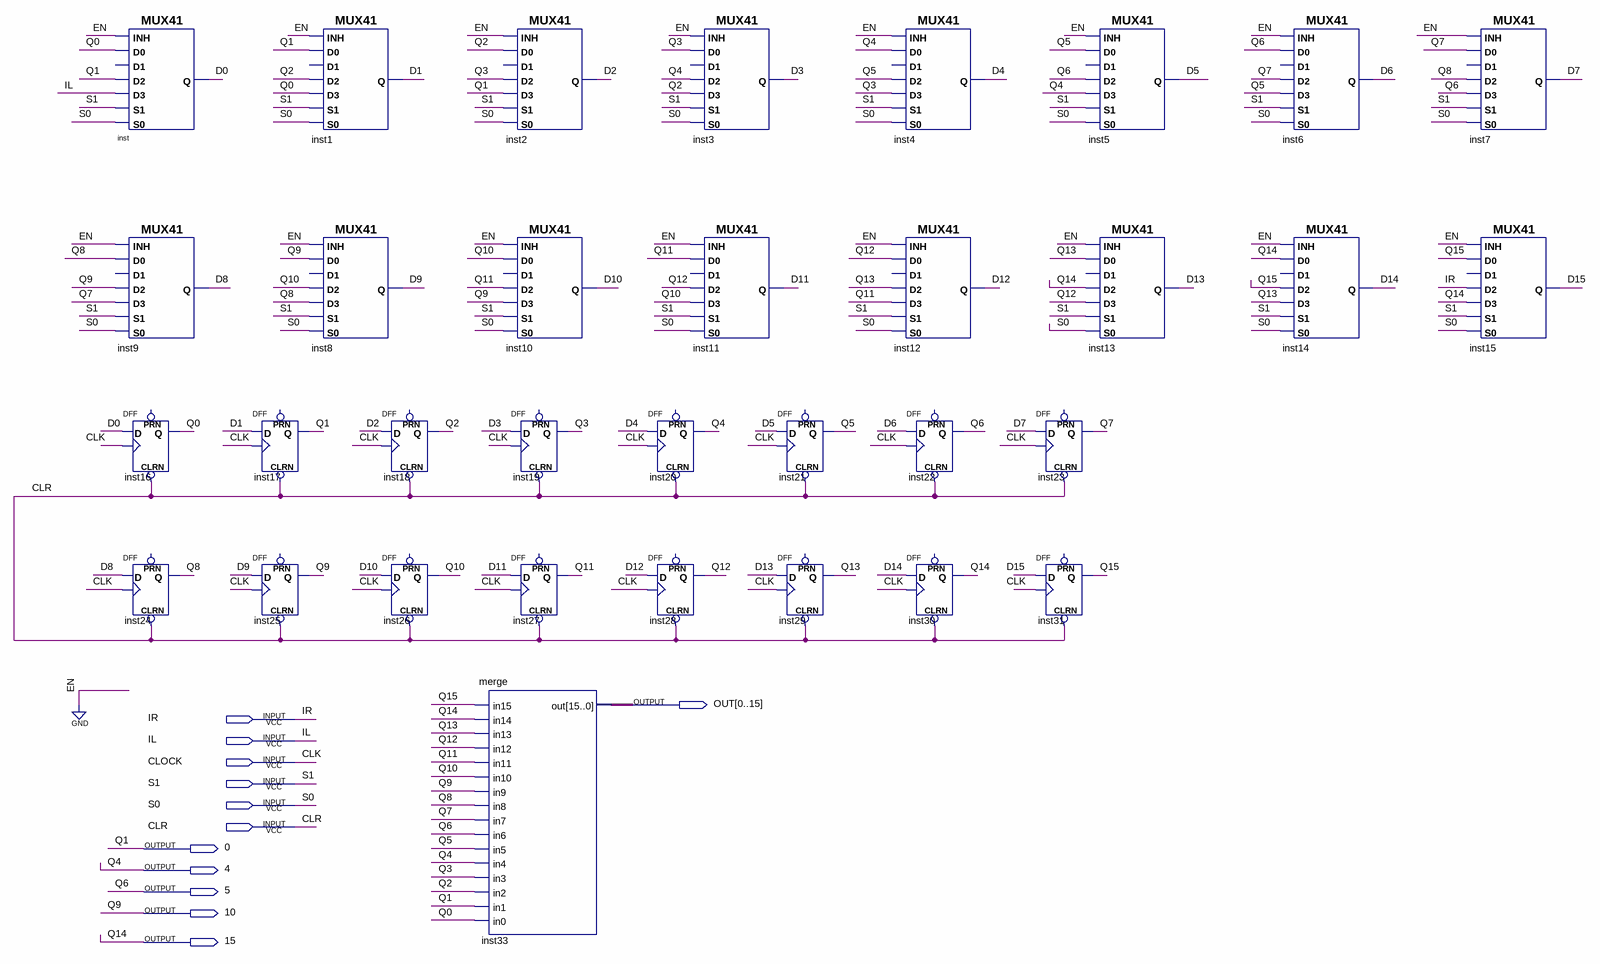
[diagram p0: schematic sheet]
// Quartus schematic Block2.bdf as structural Verilog: 33 symbols, 12 pins
module Block2 (
  input  IR,
  input  IL,
  input  CLOCK,
  input  S1,
  input  S0,
  input  CLR,
  output [0:15] OUT,
  output \0 ,
  output \4 ,
  output \5 ,
  output \10 ,
  output \15 
);

  wire D0, D1, D2, D3, D4, D5, D6, D7, D8, D9, D10, D11, D12, D13, D14, D15, Q0, Q2, Q3, Q5, Q7, Q8, Q10,
       Q11, Q12, Q13, Q15;

  MUX41 inst (.S0(S0), .D2(\0 ), .S1(S1), .D3(IL), .D0(Q0), .INH(1'b0), .Q(D0));  // open: D1
  MUX41 inst9 (.S0(S0), .D2(\10 ), .S1(S1), .D3(Q7), .D0(Q8), .INH(1'b0), .Q(D8));  // open: D1
  DFF inst16 (.CLRN(CLR), .CLK(CLOCK), .D(D0), .Q(Q0));  // open: PRN
  DFF inst24 (.CLRN(CLR), .CLK(CLOCK), .D(D8), .Q(Q8));  // open: PRN
  DFF inst17 (.CLRN(CLR), .CLK(CLOCK), .D(D1), .Q(\0 ));  // open: PRN
  DFF inst25 (.CLRN(CLR), .CLK(CLOCK), .D(D9), .Q(\10 ));  // open: PRN
  MUX41 inst1 (.S0(S0), .D2(Q2), .S1(S1), .D3(Q0), .D0(\0 ), .INH(1'b0), .Q(D1));  // open: D1
  MUX41 inst8 (.S0(S0), .D2(Q10), .S1(S1), .D3(Q8), .D0(\10 ), .INH(1'b0), .Q(D9));  // open: D1
  DFF inst18 (.CLRN(CLR), .CLK(CLOCK), .D(D2), .Q(Q2));  // open: PRN
  DFF inst26 (.CLRN(CLR), .CLK(CLOCK), .D(D10), .Q(Q10));  // open: PRN
  MUX41 inst2 (.S0(S0), .D2(Q3), .S1(S1), .D3(\0 ), .D0(Q2), .INH(1'b0), .Q(D2));  // open: D1
  MUX41 inst10 (.S0(S0), .D2(Q11), .S1(S1), .D3(\10 ), .D0(Q10), .INH(1'b0), .Q(D10));  // open: D1
  merge inst33 (
    .in15(Q15), .in14(\15 ), .in13(Q13), .in12(Q12), .in11(Q11), .in10(Q10), .in9(\10 ), .in8(Q8), .in7(Q7),
    .in6(\5 ), .in5(Q5), .in4(\4 ), .in3(Q3), .in2(Q2), .in1(\0 ), .in0(Q0), .out(OUT));
  DFF inst19 (.CLRN(CLR), .CLK(CLOCK), .D(D3), .Q(Q3));  // open: PRN
  DFF inst27 (.CLRN(CLR), .CLK(CLOCK), .D(D11), .Q(Q11));  // open: PRN
  DFF inst20 (.CLRN(CLR), .CLK(CLOCK), .D(D4), .Q(\4 ));  // open: PRN
  DFF inst28 (.CLRN(CLR), .CLK(CLOCK), .D(D12), .Q(Q12));  // open: PRN
  MUX41 inst3 (.S0(S0), .D2(\4 ), .S1(S1), .D3(Q2), .D0(Q3), .INH(1'b0), .Q(D3));  // open: D1
  MUX41 inst11 (.S0(S0), .D2(Q12), .S1(S1), .D3(Q10), .D0(Q11), .INH(1'b0), .Q(D11));  // open: D1
  DFF inst21 (.CLRN(CLR), .CLK(CLOCK), .D(D5), .Q(Q5));  // open: PRN
  DFF inst29 (.CLRN(CLR), .CLK(CLOCK), .D(D13), .Q(Q13));  // open: PRN
  MUX41 inst4 (.S0(S0), .D2(Q5), .S1(S1), .D3(Q3), .D0(\4 ), .INH(1'b0), .Q(D4));  // open: D1
  MUX41 inst12 (.S0(S0), .D2(Q13), .S1(S1), .D3(Q11), .D0(Q12), .INH(1'b0), .Q(D12));  // open: D1
  DFF inst22 (.CLRN(CLR), .CLK(CLOCK), .D(D6), .Q(\5 ));  // open: PRN
  DFF inst30 (.CLRN(CLR), .CLK(CLOCK), .D(D14), .Q(\15 ));  // open: PRN
  DFF inst23 (.CLRN(CLR), .CLK(CLOCK), .D(D7), .Q(Q7));  // open: PRN
  DFF inst31 (.CLRN(CLR), .CLK(CLOCK), .D(D15), .Q(Q15));  // open: PRN
  MUX41 inst5 (.S0(S0), .D2(\5 ), .S1(S1), .D3(\4 ), .D0(Q5), .INH(1'b0), .Q(D5));  // open: D1
  MUX41 inst13 (.S0(S0), .D2(\15 ), .S1(S1), .D3(Q12), .D0(Q13), .INH(1'b0), .Q(D13));  // open: D1
  MUX41 inst6 (.S0(S0), .D2(Q7), .S1(S1), .D3(Q5), .D0(\5 ), .INH(1'b0), .Q(D6));  // open: D1
  MUX41 inst14 (.S0(S0), .D2(Q15), .S1(S1), .D3(Q13), .D0(\15 ), .INH(1'b0), .Q(D14));  // open: D1
  MUX41 inst7 (.S0(S0), .D2(Q8), .S1(S1), .D3(\5 ), .D0(Q7), .INH(1'b0), .Q(D7));  // open: D1
  MUX41 inst15 (.S0(S0), .D2(IR), .S1(S1), .D3(\15 ), .D0(Q15), .INH(1'b0), .Q(D15));  // open: D1

  // Other names for the same wires on the sheet: CLK = CLOCK; Q1 = \0 ; Q4 = \4 ; Q6 = \5 ; Q9 = \10 ; Q14 = \15 
endmodule
